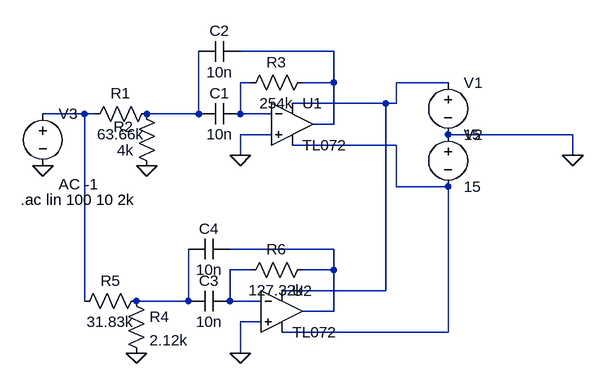
[diagram p0: schematic Filters.asc]
Filters.asc, the LTspice schematic file:
Version 4
SHEET 1 880 680
WIRE 240 48 96 48
WIRE 112 96 96 96
WIRE 240 96 240 48
WIRE 240 96 192 96
WIRE 416 96 336 96
WIRE 320 128 176 128
WIRE 336 128 336 96
WIRE 336 128 320 128
WIRE -144 144 -208 144
WIRE -128 144 -144 144
WIRE 32 144 32 48
WIRE 32 144 -48 144
WIRE 96 144 96 96
WIRE 144 144 96 144
WIRE 240 160 240 96
WIRE 240 160 208 160
WIRE 144 176 96 176
WIRE 608 176 416 176
WIRE 336 192 176 192
WIRE 96 208 96 176
WIRE 608 208 608 176
WIRE 336 256 336 192
WIRE 416 256 336 256
WIRE 240 352 80 352
WIRE 112 384 80 384
WIRE 240 384 240 352
WIRE 240 384 192 384
WIRE 320 416 320 128
WIRE 320 416 160 416
WIRE -144 432 -144 144
WIRE 16 432 16 352
WIRE 16 432 -64 432
WIRE 80 432 80 384
WIRE 128 432 80 432
WIRE 240 448 240 384
WIRE 240 448 192 448
WIRE 128 464 96 464
WIRE 416 480 416 256
WIRE 416 480 160 480
WIRE 96 512 96 464
FLAG 96 208 0
FLAG -48 224 0
FLAG -208 224 0
FLAG 608 208 0
FLAG -64 512 0
FLAG 96 512 0
SYMBOL TL072 176 96 R0
SYMATTR InstName U1
SYMBOL voltage 416 80 R0
WINDOW 123 0 0 Left 0
WINDOW 39 0 0 Left 0
SYMATTR InstName V1
SYMATTR Value 15
SYMBOL voltage 416 160 R0
WINDOW 123 0 0 Left 0
WINDOW 39 0 0 Left 0
SYMATTR InstName V2
SYMATTR Value 15
SYMBOL res -32 128 R90
WINDOW 0 0 56 VBottom 2
WINDOW 3 32 56 VTop 2
SYMATTR InstName R1
SYMATTR Value 63.66k
SYMBOL res -32 240 R180
WINDOW 0 36 76 Left 2
WINDOW 3 36 40 Left 2
SYMATTR InstName R2
SYMATTR Value 4k
SYMBOL cap 32 128 M90
WINDOW 0 0 32 VBottom 2
WINDOW 3 32 32 VTop 2
SYMATTR InstName C1
SYMATTR Value 10n
SYMBOL cap 32 32 M90
WINDOW 0 0 32 VBottom 2
WINDOW 3 32 32 VTop 2
SYMATTR InstName C2
SYMATTR Value 10n
SYMBOL res 208 80 R90
WINDOW 0 0 56 VBottom 2
WINDOW 3 32 56 VTop 2
SYMATTR InstName R3
SYMATTR Value 254k
SYMBOL voltage -208 128 R0
WINDOW 123 24 124 Left 2
WINDOW 39 0 0 Left 0
SYMATTR InstName V3
SYMATTR Value ""
SYMATTR Value2 AC -1
SYMBOL TL072 160 384 R0
SYMATTR InstName U2
SYMBOL res -80 416 R0
SYMATTR InstName R4
SYMATTR Value 2.12k
SYMBOL res -48 416 R90
WINDOW 0 0 56 VBottom 2
WINDOW 3 32 56 VTop 2
SYMATTR InstName R5
SYMATTR Value 31.83k
SYMBOL cap 80 416 R90
WINDOW 0 0 32 VBottom 2
WINDOW 3 32 32 VTop 2
SYMATTR InstName C3
SYMATTR Value 10n
SYMBOL cap 80 336 R90
WINDOW 0 0 32 VBottom 2
WINDOW 3 32 32 VTop 2
SYMATTR InstName C4
SYMATTR Value 10n
SYMBOL res 208 368 R90
WINDOW 0 0 56 VBottom 2
WINDOW 3 32 56 VTop 2
SYMATTR InstName R6
SYMATTR Value 127.32k
TEXT -242 276 Left 2 !.ac lin 100 10 2k

The netlist it stands for:
* Filters.asc
* U1: TL072 (symbol TL072 not available, pins judged from their places): In+=0 In-=N002 V+=N003 V-=N006 OUT=N001
V1 N003 0 15
V2 0 N006 15
R1 N005 N004 63.66k
R2 0 N005 4k
C1 N005 N002 10n
C2 N005 N001 10n
R3 N001 N002 254k
V3 N004 0 AC -1
* U2: TL072 (symbol TL072 not available, pins judged from their places): In+=0 In-=N008 V+=N003 V-=N006 OUT=N007
R4 N009 0 2.12k
R5 N009 N004 31.83k
C3 N008 N009 10n
C4 N007 N009 10n
R6 N007 N008 127.32k
.ac lin 100 10 2k
.backanno
.end